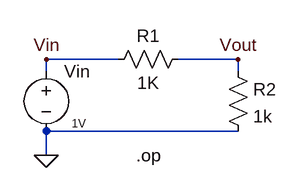
[diagram p0: schematic op_dir_sim.asc]
op_dir_sim.asc, the LTspice schematic file:
Version 4
SHEET 1 880 680
WIRE 288 96 192 96
WIRE 448 96 368 96
WIRE 192 112 192 96
WIRE 448 112 448 96
WIRE 448 192 192 192
WIRE 192 224 192 192
FLAG 192 224 0
FLAG 448 96 Vout
FLAG 192 96 Vin
SYMBOL voltage 192 96 R0
WINDOW 3 34 86 Left 1
SYMATTR InstName Vin
SYMATTR Value 1V
SYMBOL res 272 112 R270
WINDOW 0 32 56 VTop 2
WINDOW 3 0 56 VBottom 2
SYMATTR InstName R1
SYMATTR Value 1K
SYMATTR SpiceLine tol=1 pwr=0.1
SYMBOL res 432 96 R0
SYMATTR InstName R2
SYMATTR Value 1k
TEXT 312 224 Left 2 !.op

The netlist it stands for:
* op_dir_sim.asc
Vin Vin 0 1V
R1 Vin Vout 1K tol=1 pwr=0.1
R2 Vout 0 1k
.op
.backanno
.end